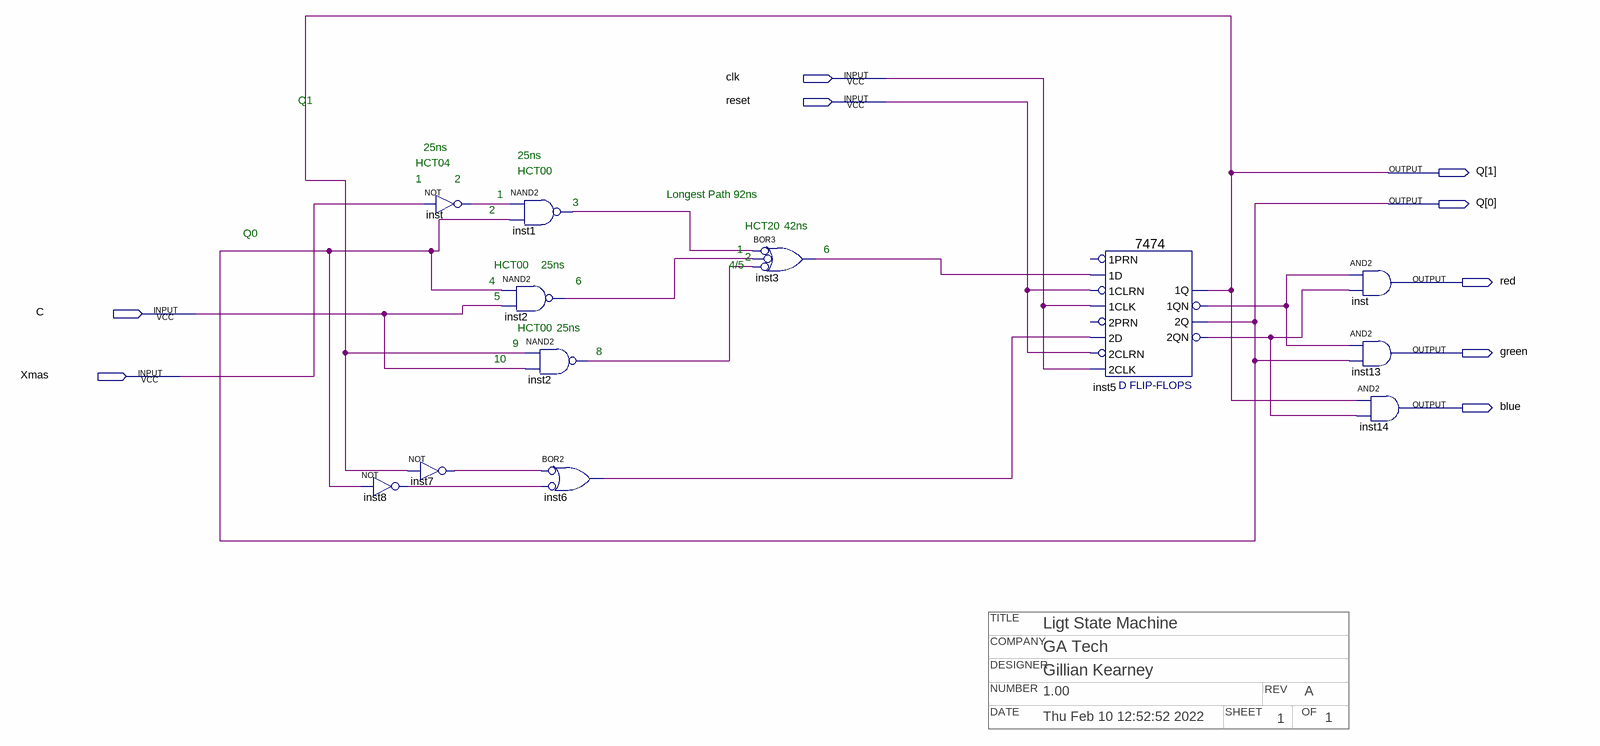
[diagram p0: schematic sheet]
// Quartus schematic PropDelaySchematic.bdf as structural Verilog: 12 symbols, 9 pins
// Title block: COMPANY: GA Tech; DATE: Thu Feb 10 12:52:52 2022; DESIGNER: Gillian Kearney; NUMBER: 1.00; OF: 1; REV: A; SHEET: 1; TITLE: Ligt State Machine
module PropDelaySchematic (
  input  clk,
  input  reset,
  input  C,
  input  Xmas,
  output [1:0] Q,
  output red,
  output green,
  output blue
);

  wire inst1_out, inst2_out, inst2_out_2, inst3_out, inst5_1qn, inst5_2qn, inst6_out, inst7_out, inst8_out,
       inst_out;

  not inst8 (inst8_out, Q[0]);
  not inst (inst_out, Xmas);
  not inst7 (inst7_out, Q[1]);
  nand inst1 (inst1_out, inst_out, Q[0]);
  nand inst2 (inst2_out, Q[0], C);
  nand inst2_dup2 (inst2_out_2, Q[1], C);
  or inst6 (inst6_out, ~inst7_out, ~inst8_out);  // BOR2
  or inst3 (inst3_out, ~inst1_out, ~inst2_out, ~inst2_out_2);  // BOR3
  \7474  inst5 (
    .\2D (inst6_out), .\1CLK (clk), .\1D (inst3_out), .\2CLK (clk), .\2CLRN (reset), .\1CLRN (reset),
    .\1QN (inst5_1qn), .\2Q (Q[0]), .\2QN (inst5_2qn), .\1Q (Q[1]));  // open: 2PRN, 1PRN
  and inst_dup2 (red, inst5_1qn, inst5_2qn);
  and inst13 (green, inst5_1qn, Q[0]);
  // AND2 inst14 has open pins: IN1=Q[1], IN2=inst5_2qn, OUT=open

  // Notes on the sheet:
  //   Q1
  //   25ns
  //   25ns
  //   HCT04
  //   HCT00
  //   1
  //   2
  //    1
  //   Longest Path 92ns
  //   3
  //    2
  //   HCT20
  //   42ns
  //   Q0
  //   1
  //   6
  //   2
  //   HCT00
  //   25ns
  //   4/5
  //    4
  //    6
  //   5
  //   HCT00
  //   25ns
  //    9
  //   8
  //   10
endmodule
